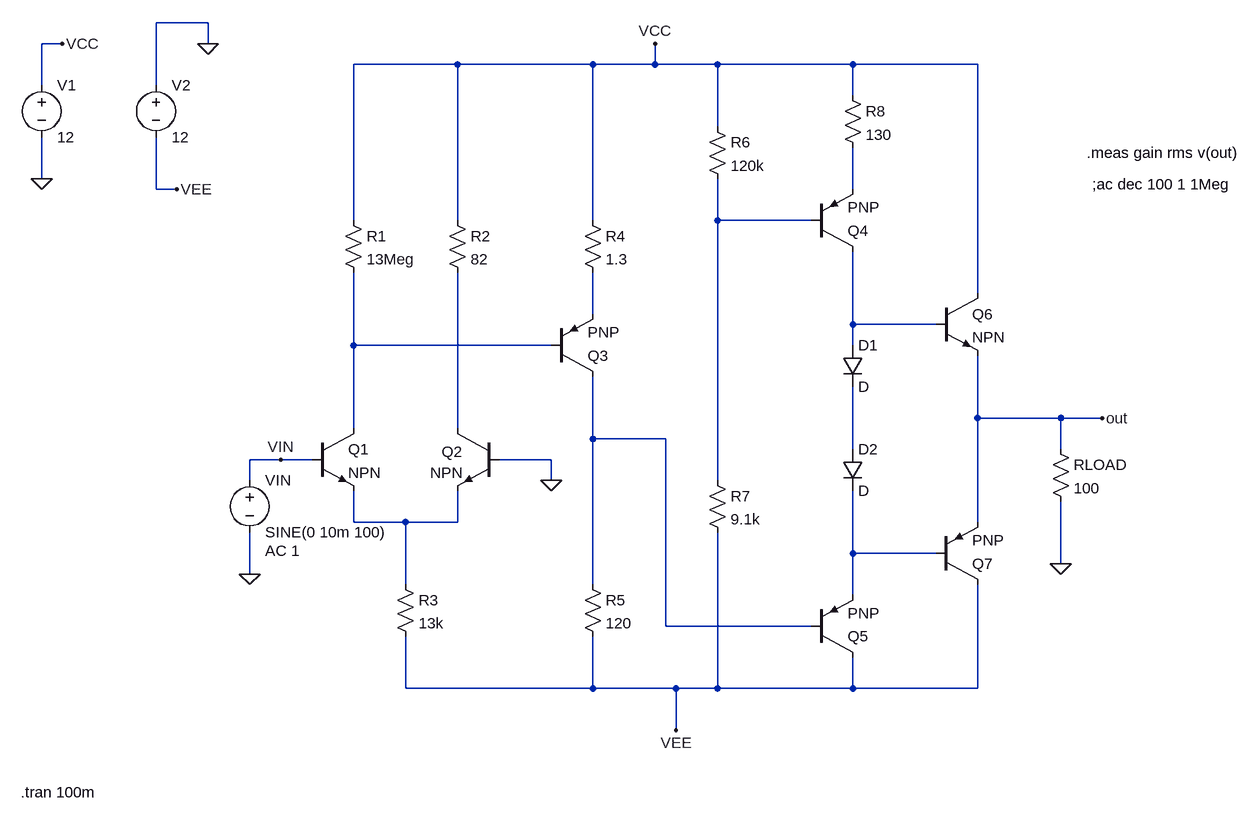
[diagram p0: schematic bjt_opamp.asc]
bjt_opamp.asc, the LTspice schematic file:
Version 4
SHEET 1 2412 720
WIRE 720 -480 640 -480
WIRE 496 -448 464 -448
WIRE 720 -448 720 -480
WIRE 1104 -416 944 -416
WIRE 1312 -416 1104 -416
WIRE 1408 -416 1408 -448
WIRE 1408 -416 1312 -416
WIRE 1504 -416 1408 -416
WIRE 1712 -416 1504 -416
WIRE 1904 -416 1712 -416
WIRE 464 -384 464 -448
WIRE 640 -384 640 -480
WIRE 1712 -368 1712 -416
WIRE 1504 -320 1504 -416
WIRE 464 -240 464 -304
WIRE 640 -224 640 -304
WIRE 672 -224 640 -224
WIRE 1712 -224 1712 -288
WIRE 944 -176 944 -416
WIRE 1104 -176 1104 -416
WIRE 1312 -176 1312 -416
WIRE 1504 -176 1504 -240
WIRE 1648 -176 1504 -176
WIRE 1904 -64 1904 -416
WIRE 1312 -32 1312 -96
WIRE 1712 -16 1712 -128
WIRE 1840 -16 1712 -16
WIRE 944 16 944 -96
WIRE 1248 16 944 16
WIRE 1712 16 1712 -16
WIRE 1904 128 1904 32
WIRE 2032 128 1904 128
WIRE 2096 128 2032 128
WIRE 944 144 944 16
WIRE 1104 144 1104 -96
WIRE 1312 160 1312 64
WIRE 1424 160 1312 160
WIRE 1712 176 1712 80
WIRE 2032 176 2032 128
WIRE 832 192 784 192
WIRE 880 192 832 192
WIRE 1248 192 1168 192
WIRE 784 224 784 192
WIRE 1248 224 1248 192
WIRE 1504 224 1504 -176
WIRE 944 288 944 240
WIRE 1024 288 944 288
WIRE 1104 288 1104 240
WIRE 1104 288 1024 288
WIRE 1904 288 1904 128
WIRE 1712 336 1712 240
WIRE 1840 336 1712 336
WIRE 2032 352 2032 256
WIRE 784 368 784 304
WIRE 1024 384 1024 288
WIRE 1312 384 1312 160
WIRE 1712 400 1712 336
WIRE 1424 448 1424 160
WIRE 1648 448 1424 448
WIRE 1024 544 1024 464
WIRE 1312 544 1312 464
WIRE 1312 544 1024 544
WIRE 1440 544 1312 544
WIRE 1504 544 1504 304
WIRE 1504 544 1440 544
WIRE 1712 544 1712 496
WIRE 1712 544 1504 544
WIRE 1904 544 1904 384
WIRE 1904 544 1712 544
WIRE 1440 608 1440 544
FLAG 1248 224 0
FLAG 2032 352 0
FLAG 464 -240 0
FLAG 720 -448 0
FLAG 496 -448 VCC
FLAG 672 -224 VEE
FLAG 2096 128 out
FLAG 784 368 0
FLAG 1408 -448 VCC
FLAG 1440 608 VEE
FLAG 832 192 VIN
SYMBOL npn 880 144 R0
SYMATTR InstName Q1
SYMBOL npn 1168 144 M0
WINDOW 0 56 36 Left 2
SYMATTR InstName Q2
SYMBOL res 928 -192 R0
SYMATTR InstName R1
SYMATTR Value 13Meg
SYMBOL res 1088 -192 R0
SYMATTR InstName R2
SYMATTR Value 82
SYMBOL res 1008 368 R0
SYMATTR InstName R3
SYMATTR Value 13k
SYMBOL res 1296 -192 R0
SYMATTR InstName R4
SYMATTR Value 1.3
SYMBOL res 1296 368 R0
SYMATTR InstName R5
SYMATTR Value 120
SYMBOL res 1488 -336 R0
SYMATTR InstName R6
SYMATTR Value 120k
SYMBOL res 1488 208 R0
SYMATTR InstName R7
SYMATTR Value 9.1k
SYMBOL res 1696 -384 R0
SYMATTR InstName R8
SYMATTR Value 130
SYMBOL res 2016 160 R0
SYMATTR InstName RLOAD
SYMATTR Value 100
SYMBOL pnp 1248 64 M180
SYMATTR InstName Q3
SYMBOL pnp 1648 -128 M180
SYMATTR InstName Q4
SYMBOL pnp 1648 496 M180
SYMATTR InstName Q5
SYMBOL npn 1840 -64 R0
SYMATTR InstName Q6
SYMBOL diode 1696 16 R0
SYMATTR InstName D1
SYMBOL diode 1696 176 R0
SYMATTR InstName D2
SYMBOL pnp 1840 384 M180
SYMATTR InstName Q7
SYMBOL voltage 464 -400 R0
SYMATTR InstName V1
SYMATTR Value 12
SYMBOL voltage 640 -400 R0
SYMATTR InstName V2
SYMATTR Value 12
SYMBOL voltage 784 208 R0
WINDOW 123 24 124 Left 2
WINDOW 39 0 0 Left 0
SYMATTR Value2 AC 1
SYMATTR InstName VIN
SYMATTR Value SINE(0 10m 100)
TEXT 2072 -280 Left 2 !.meas gain rms v(out)
TEXT 432 704 Left 2 !.tran 100m
TEXT 2080 -232 Left 2 !;ac dec 100 1 1Meg

The netlist it stands for:
* bjt_opamp.asc
Q1 N005 VIN N009 0 NPN
Q2 N006 0 N009 0 NPN
R1 VCC N005 13Meg
R2 VCC N006 82
R3 N009 VEE 13k
R4 VCC N003 1.3
R5 N007 VEE 120
R6 VCC N002 120k
R7 N002 VEE 9.1k
R8 VCC N001 130
RLOAD out 0 100
Q3 N007 N005 N003 0 PNP
Q4 N004 N002 N001 0 PNP
Q5 VEE N007 N010 0 PNP
Q6 VCC N004 out 0 NPN
D1 N004 N008 D
D2 N008 N010 D
Q7 VEE N010 out 0 PNP
V1 VCC 0 12
V2 0 VEE 12
VIN VIN 0 SINE(0 10m 100) AC 1
.model D D
.lib standard.dio
.model NPN NPN
.model PNP PNP
.lib standard.bjt
.meas gain rms v(out)
.tran 100m
;ac dec 100 1 1Meg
.backanno
.end